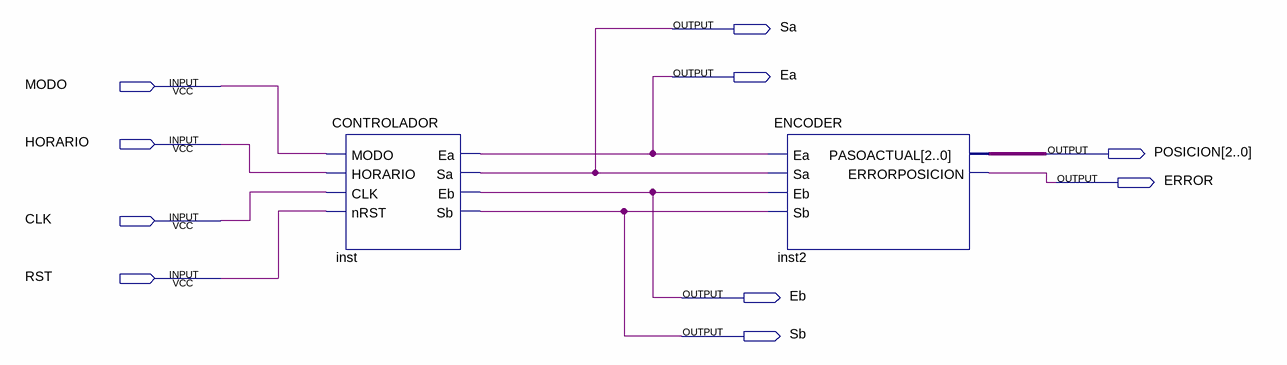
[diagram p0: schematic sheet]
// Quartus schematic MOTOR.bdf as structural Verilog: 2 symbols, 10 pins
module MOTOR (
  input  MODO,
  input  HORARIO,
  input  CLK,
  input  RST,
  output Sa,
  output Ea,
  output [2:0] POSICION,
  output ERROR,
  output Eb,
  output Sb
);

  CONTROLADOR inst (.MODO(MODO), .HORARIO(HORARIO), .CLK(CLK), .nRST(RST), .Ea(Ea), .Sa(Sa), .Eb(Eb), .Sb(Sb));
  ENCODER inst2 (.Ea(Ea), .Sa(Sa), .Eb(Eb), .Sb(Sb), .PASOACTUAL(POSICION), .ERRORPOSICION(ERROR));
endmodule
